# Altium schematic sheet 12_PSRAM.SchDoc
size A4; SheetNumber: 12; SheetTotal: 13
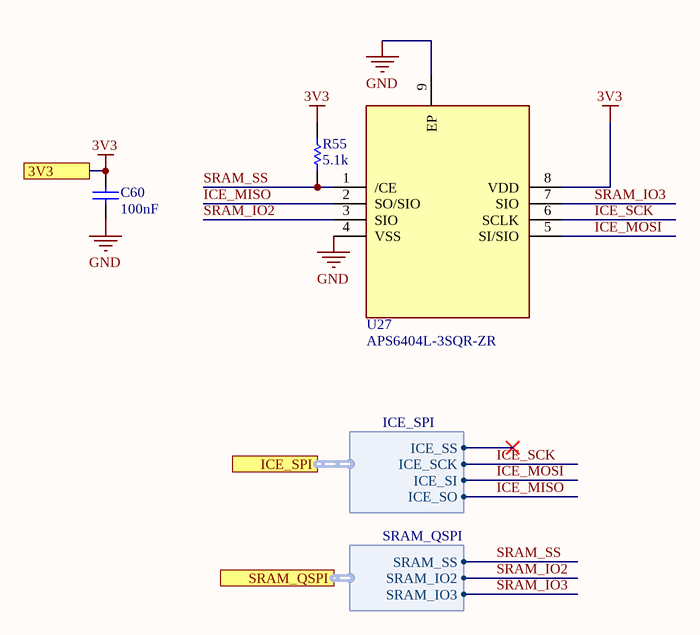
[diagram p0: 12_PSRAM.SchDoc]

## Parts
C60  100nF  [CAPC1608X90X35LL15T15]
R55  5.1k  [RESC1609X55X30NL10T20]
U27  APS6404L-3SQR-ZR  [USON-8_L3.0-W2.0-P0.50-BL-EP]

## Ports
3V3, ICE_SPI (harness ICE_SPI), SRAM_QSPI (harness SRAM_QSPI)

## Harnesses
ICE_SPI: ICE_SO, ICE_SI, ICE_SCK, ICE_SS
SRAM_QSPI: SRAM_IO3, SRAM_IO2, SRAM_SS

## Nets
3V3: C60.2 R55.2 U27.8(VDD) ; port 3V3
GND: C60.1 U27.4(VSS) U27.9(EP)
ICE_MISO: U27.2(SO/SIO) ; port ICE_SPI.ICE_SO
ICE_MOSI: U27.5(SI/SIO) ; port ICE_SPI.ICE_SI
ICE_SCK: U27.6(SCLK) ; port ICE_SPI.ICE_SCK
SRAM_IO2: U27.3(SIO) ; port SRAM_QSPI.SRAM_IO2
SRAM_IO3: U27.7(SIO) ; port SRAM_QSPI.SRAM_IO3
SRAM_SS: R55.1 U27.1(/CE) ; port SRAM_QSPI.SRAM_SS

## Notes on the sheet
- Date:
- A4
- Project:
- Time:
- Sheet
- of
- Revision:
- File:
- Drawn By:

## Library data of the parts
C60 = CMP-2006-02241-1: Part Number: C0603C105K9PACTU; Manufacturer: Kemet
R55 = CMP-2000-03692-1: Manufacturer: Vishay Dale; Part Number: TNPW060310K0BEEN
U27 = CMP-019-000007-1: Manufacturer: Apmemory; LCSC Part Name: APS6404L-3SQR-ZR; Supplier Footprint: USON-8L; JLCPCB Part Class: Extended Part; Design Item ID: APS6404L-3SQR-ZR; Source: EasyEDA.schlib; Supplier Part: C3040877; Manufacturer Part: APS6404L-3SQR-ZR